# EAGLE design 220_power (EAGLE 7.1.0)
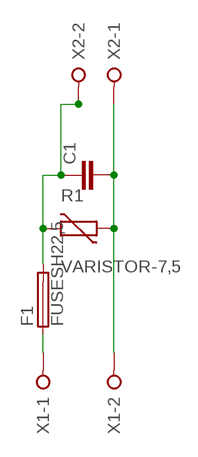
[diagram p0: schematic, sheet 1]

## Parts
C1  C15/8  [C15B8]
F1  FUSESH22,5  [SH22,5]
R1  VARISTOR-7,5  [R-7,5]
X1  W237-02P  [W237-132]
X2  W237-02P  [W237-132]

## Nets
N$1: F1.1 X1.1
N$2: C1.1 F1.2 R1.2 X2.2
N$3: C1.2 R1.1 X1.2 X2.1

## Library data of the parts
C1 = capacitor-wima:C: CAPACITOR naming: grid - package width
F1 = fuse:FUSE: Fuse; OC_FARNELL: unknown; OC_NEWARK: unknown
R1 = varistor:VARISTOR: VARISTOR
X1 X2 = con-wago-508:W237-02P: WAGO SREW CLAMP; OC_FARNELL: unknown; OC_NEWARK: unknown

## Board
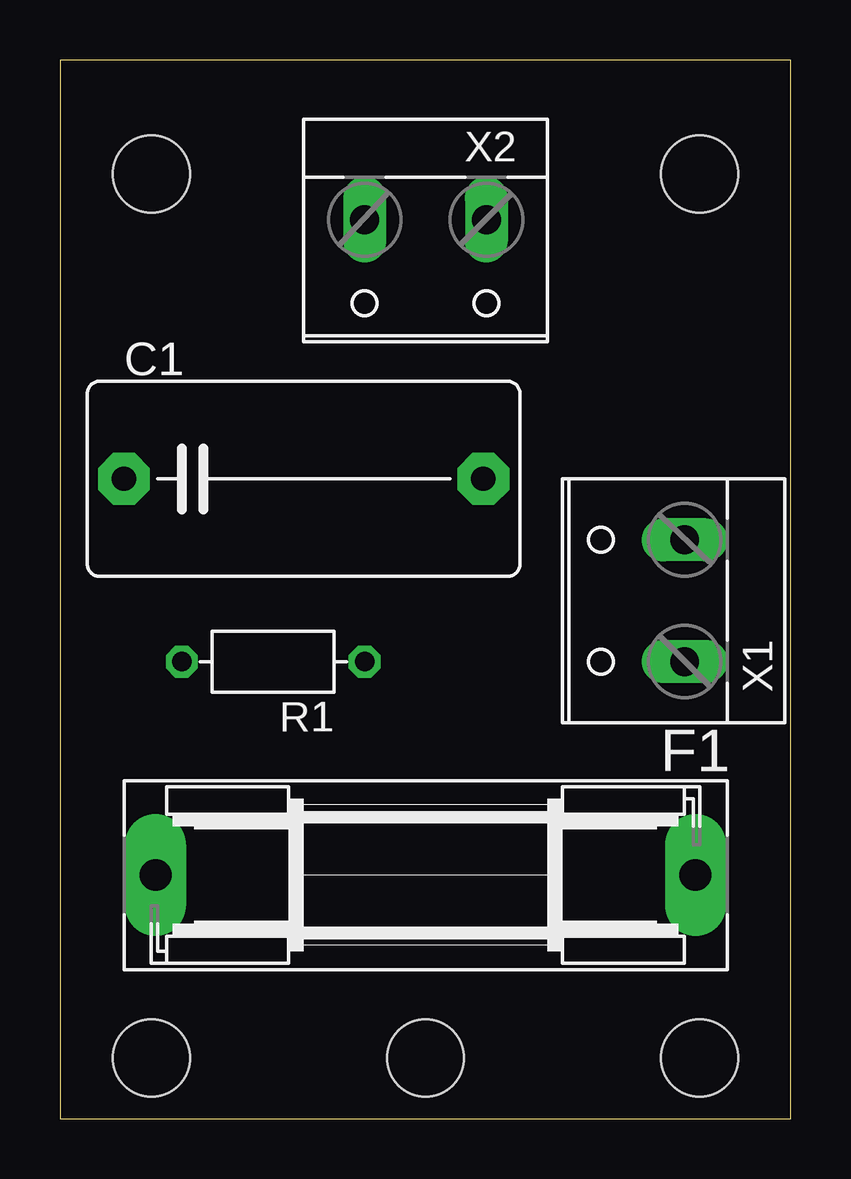
[diagram p1: board, top side]
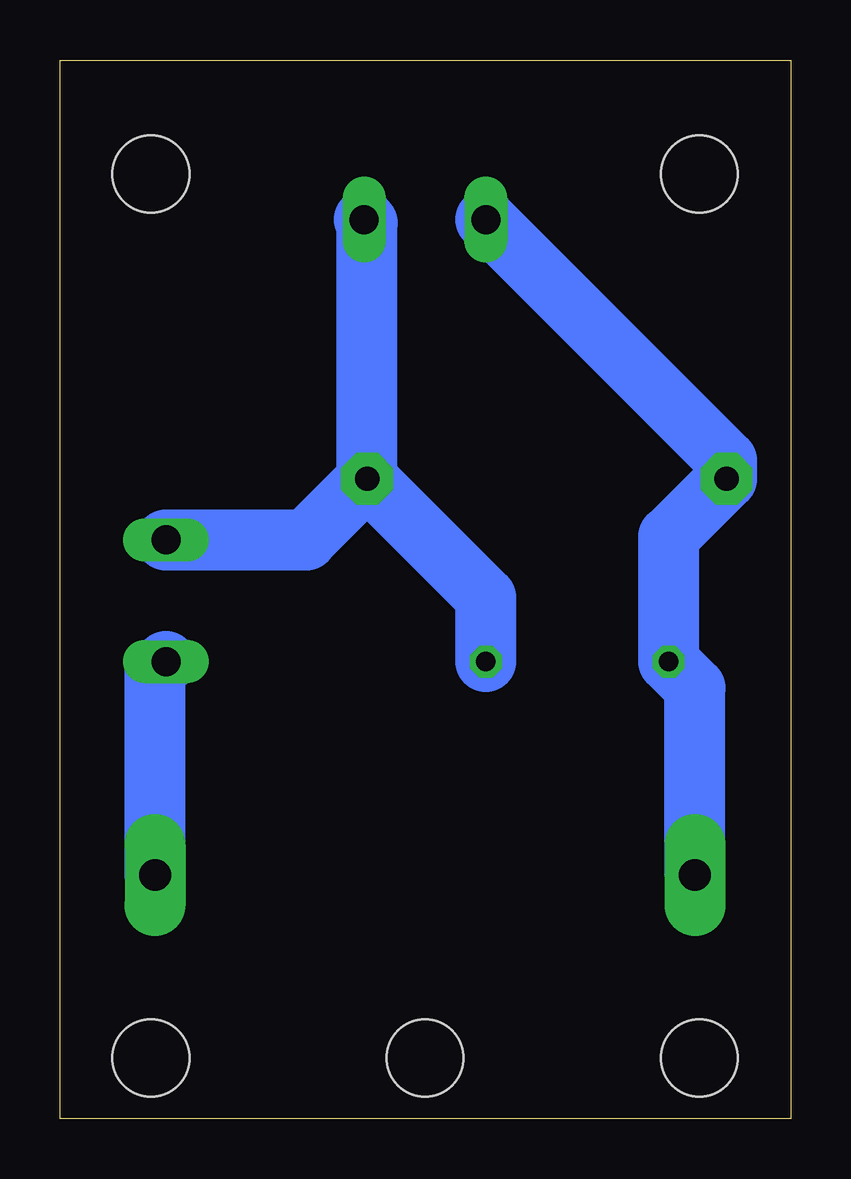
[diagram p2: board, bottom side, seen from below]

Size 30.46 x 44.12 mm. Coordinates in mm from the lower left corner, seen from the top.
Outline: 0,0 30.46,0 30.46,44.12 0,44.12 0,0
Copper layers (1*16): Top 0.035mm / dielectric 1.5mm / Bottom 0.035mm
Design rules "default": minimum track width 10mil, minimum drill 24mil, track to track 8mil, track to pad 8mil, pad to pad 8mil, via to via 8mil, smd to smd 8mil, copper to edge 40mil, drill to drill 8mil, minimum pad ring 10mil, minimum via ring 8mil, stop-mask expansion 4mil, vias tented up to drill 0mil, thermal gap 10mil
Holes 3.2 mm at 3.81,39.37 26.67,39.37 15.24,2.54 26.67,2.54 3.81,2.54

### Footprints (pad centres in the part's own frame; a part is rotated, then mirrored left to right if it is on the bottom)
C15B8 = drill 1.016 pad 2.159 octagon: 1 -7.493,0; 2 7.493,0
SH22,5 = drill 1.321 pad 2.54 long: 1 -11.252,0; 2 11.252,0
R-7,5 = drill 0.813 octagon: 1 -3.81,0; 2 3.81,0
W237-132 = drill 1.194 long: 1 -2.54,-0.635; 2 2.54,-0.635

### Placement (x,y rotation side)
C1  10.16,26.67 0 top
F1  15.24,10.16 180 top
R1  8.89,19.05 180 top
X1  25.4,21.59 90 top
X2  15.24,36.83 180 top

### Tracks (layer width: path | path; a pad name or v marks a point on that pad's centre or on a via)
N$1
  Bottom 2.54: F1.1 26.49,18.59 X1.1
N$2
  Bottom 2.54: F1.2 3.99,17.96 R1.2 5.08,24.26 C1.1 2.67,27.43 X2.2
N$3
  Bottom 2.54: C1.2 20.19,24.13 X1.2 | R1.1 12.7,21.72 C1.2 | C1.2 17.65,37.34 X2.1